# EasyEDA Pro project New Project_2025-03-25_15-12-27.eprj, schematic Schematic1

## Sheets
1 P1: Board Name: Board1; Create Date: 2025-03-25; Page Name: P1; Project Name: New Project_2025-03-25_15-12-27; Schematic Name: Schematic1; Update Date: 2025-03-27; Company: 嘉立创EDA; Page Size: A4; Version: V1.0
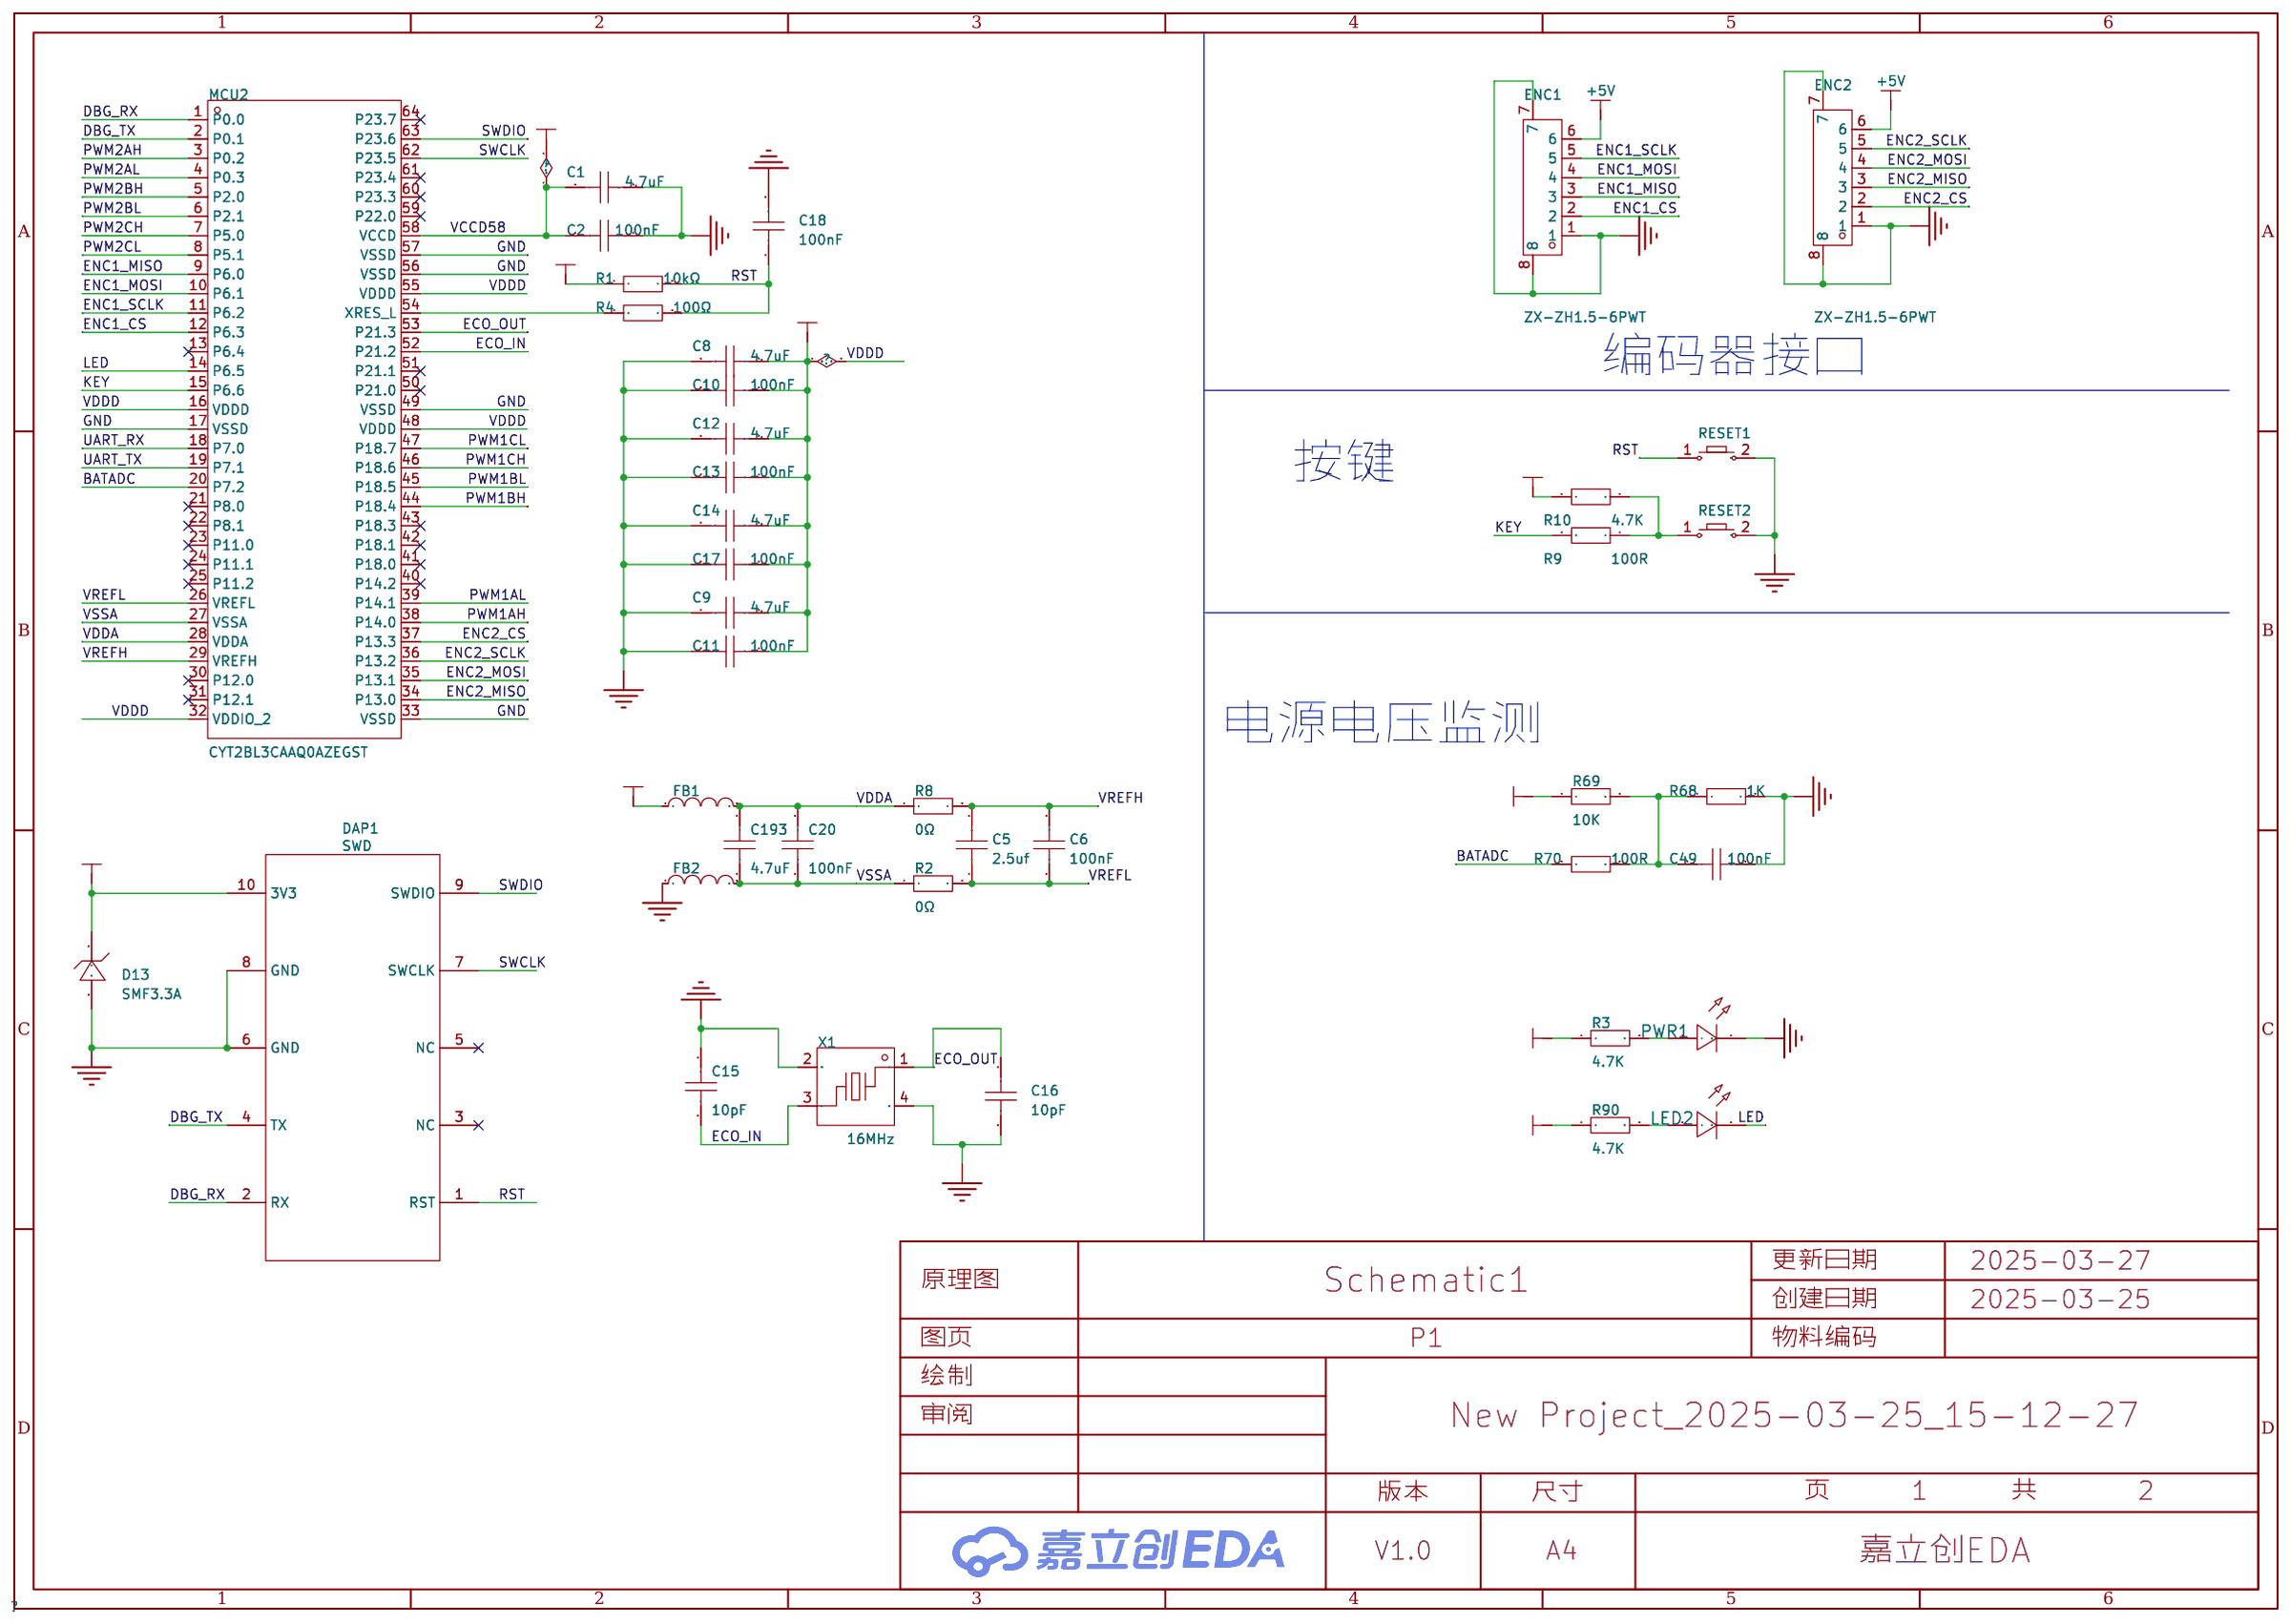
[diagram p0: P1]
2 P2: Create Date: 2025-03-27; Page Name: P2
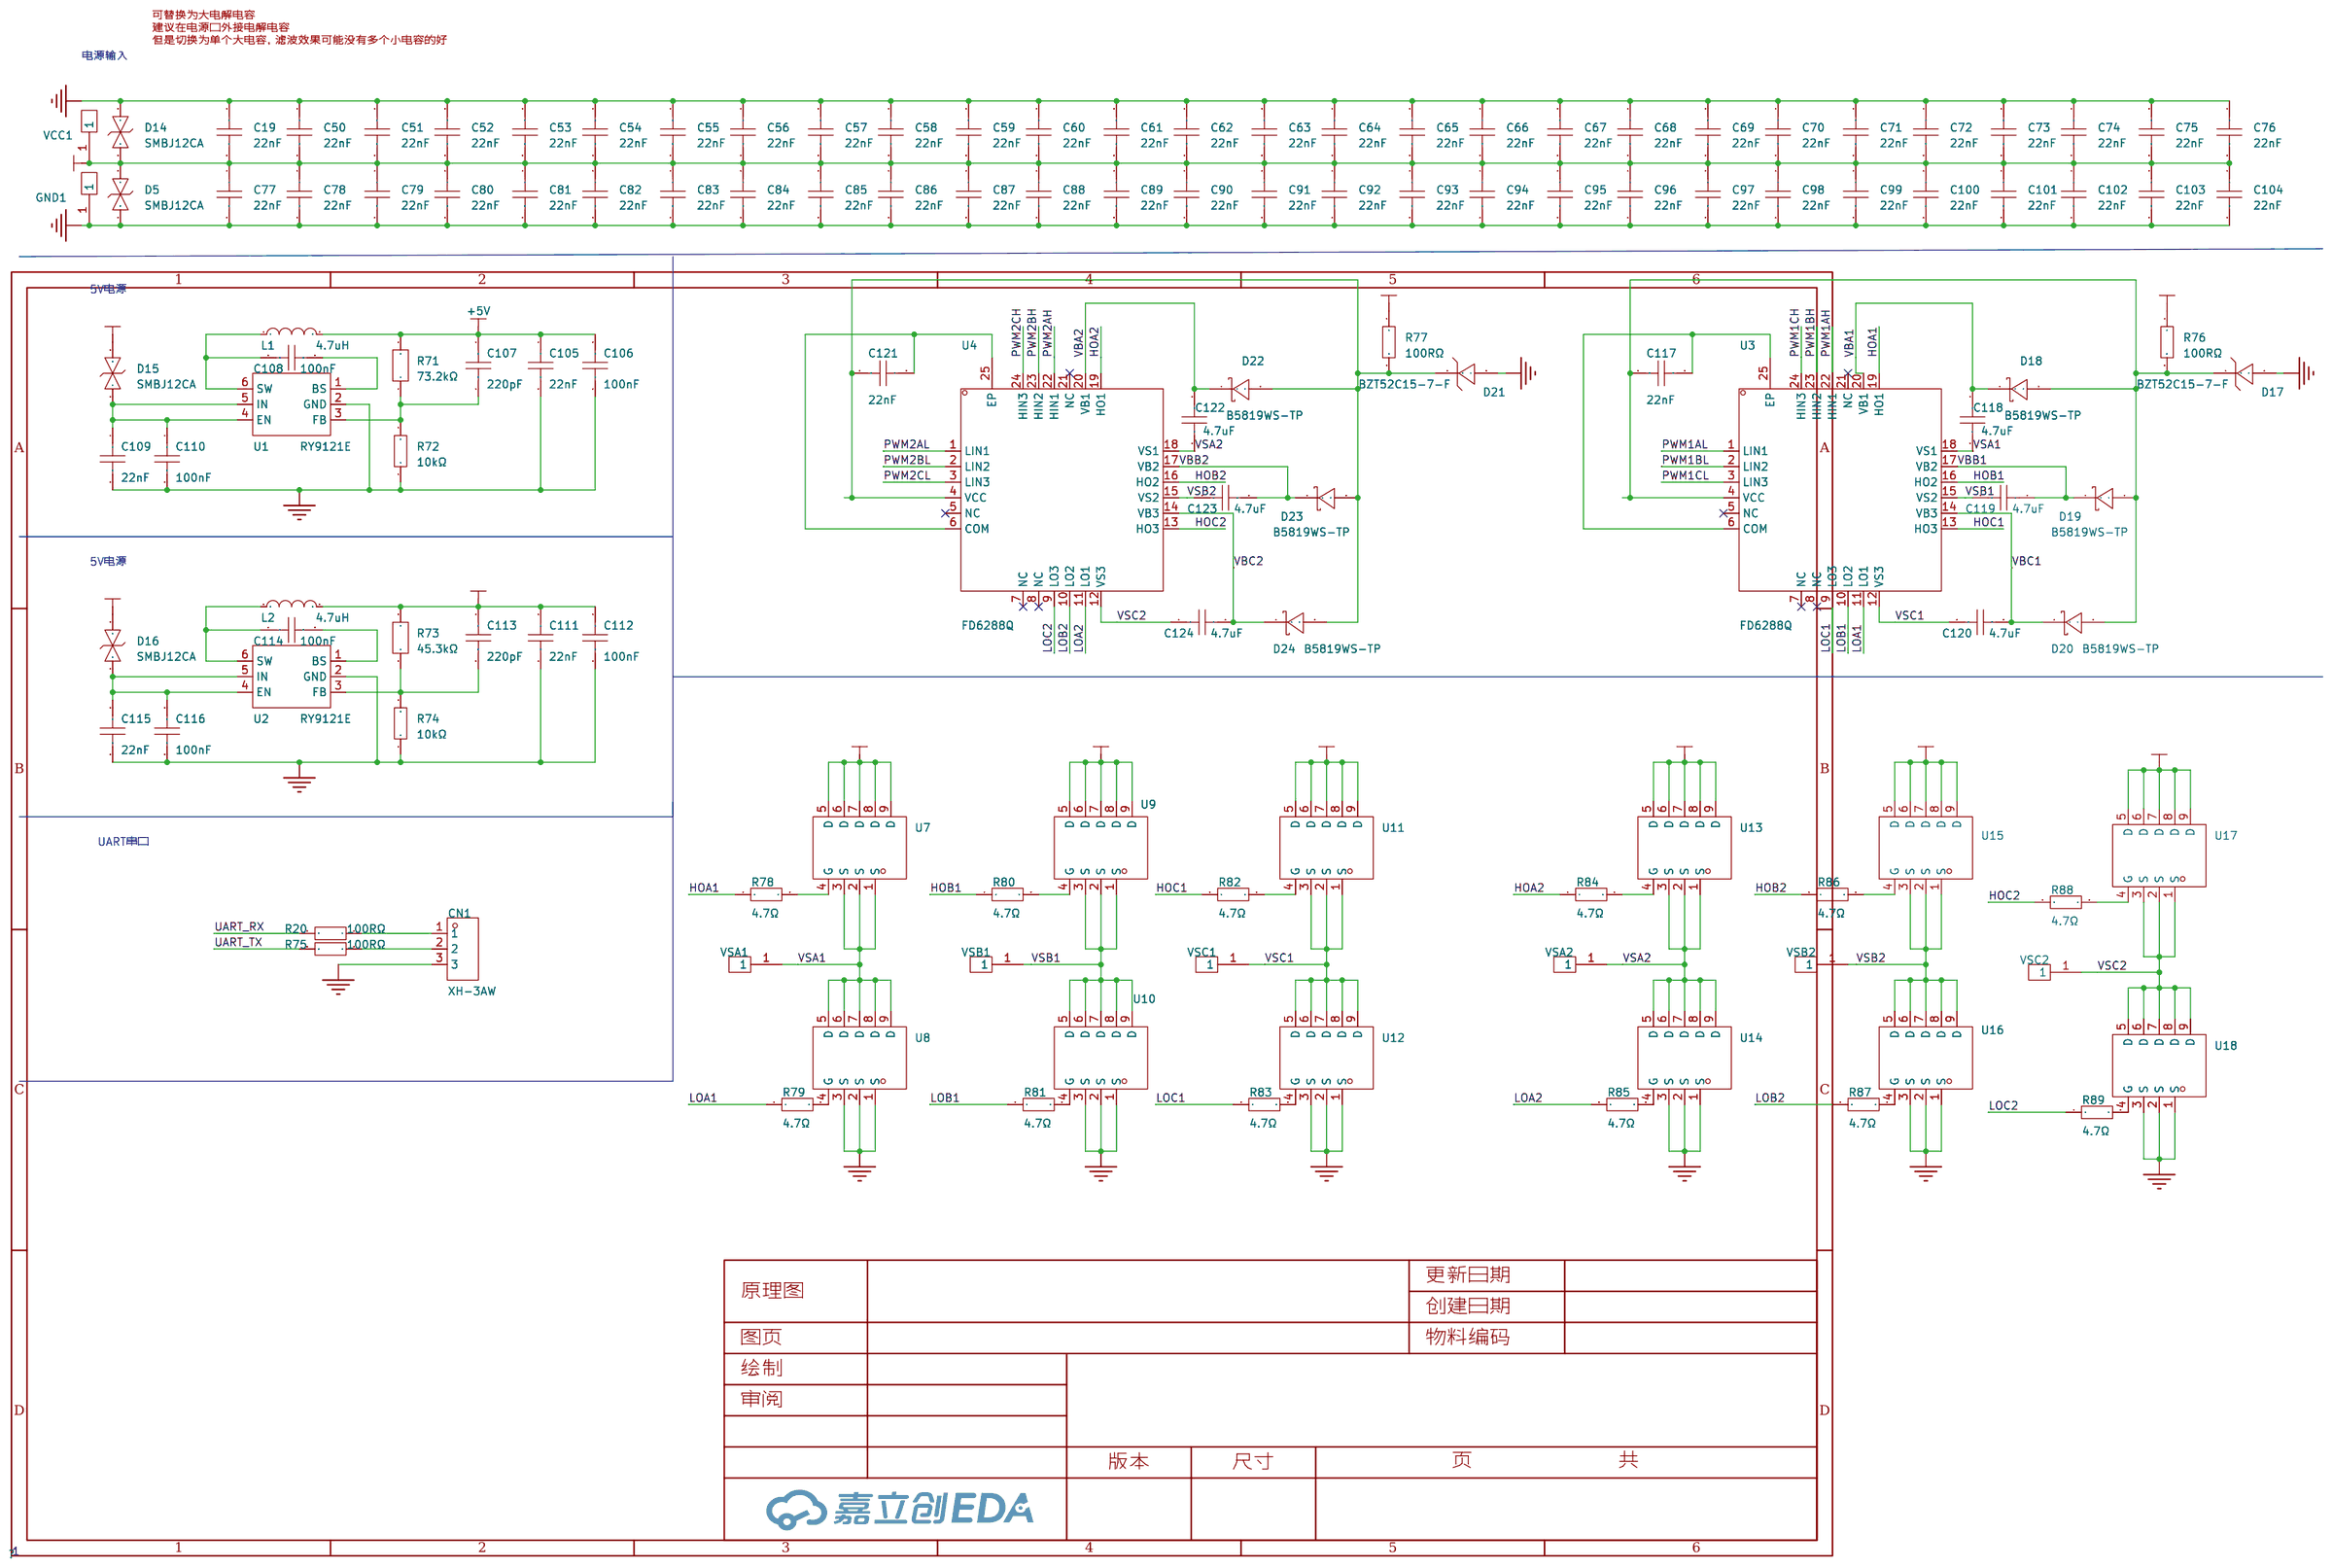
[diagram p1: P2]

## Parts
sheet P1
C1  4.7uF  [C0603]
C2  100nF  [C0603]
C5  2.5uf  [C0603]
C6  100nF  [C0603]
C8  4.7uF  [C0603]
C9  4.7uF  [C0603]
C10  100nF  [C0603]
C11  100nF  [C0603]
C12  4.7uF  [C0603]
C13  100nF  [C0603]
C14  4.7uF  [C0603]
C15  10pF  [C0603]
C16  10pF  [C0603]
C17  100nF  [C0603]
C18  100nF  [C0603]
C20  100nF  [C0603]
C49  100nF  [C0603]
C193  4.7uF  [C0603]
D13  SMF3.3A  [SOD-123_L2.8-W1.8-LS3.7-RD]
DAP1  SWD  [2X5 2.54MM双层贴片焊盘]
ENC1  ZX-ZH1.5-6PWT  [CONN-SMD_6P-P1.50_ZX-ZH1.5-6PWT]
ENC2  ZX-ZH1.5-6PWT  [CONN-SMD_6P-P1.50_ZX-ZH1.5-6PWT]
FB1  BLM18PG121SN1D  [L0603]
FB2  BLM18PG121SN1D  [L0603]
LED2  -  [LED_0603]
MCU2  CYT2BL3CAAQ0AZEGST  [LQFP-64_L10.0-W10.0-P0.50-LS12.0-BL]
PWR1  -  [LED_0603]
R1  10kΩ  [R0603]
R2  0Ω  [R0603]
R3  4.7K  [R0603]
R4  100Ω  [R0603]
R8  0Ω  [R0603]
R9  100R  [R0603]
R10  4.7K  [R0603]
R68  1K  [R0603]
R69  10K  [R0603]
R70  100R  [R0603]
R90  4.7K  [R0603]
RESET1  -  [Key_SMD_3x4x2]
RESET2  -  [Key_SMD_3x4x2]
X1  16MHz  [CRYSTAL-SMD_4P-L2.0-W1.6-BL]
sheet P2
C19  22nF  [C0603]
C50  22nF  [C0603]
C51  22nF  [C0603]
C52  22nF  [C0603]
C53  22nF  [C0603]
C54  22nF  [C0603]
C55  22nF  [C0603]
C56  22nF  [C0603]
C57  22nF  [C0603]
C58  22nF  [C0603]
C59  22nF  [C0603]
C60  22nF  [C0603]
C61  22nF  [C0603]
C62  22nF  [C0603]
C63  22nF  [C0603]
C64  22nF  [C0603]
C65  22nF  [C0603]
C66  22nF  [C0603]
C67  22nF  [C0603]
C68  22nF  [C0603]
C69  22nF  [C0603]
C70  22nF  [C0603]
C71  22nF  [C0603]
C72  22nF  [C0603]
C73  22nF  [C0603]
C74  22nF  [C0603]
C75  22nF  [C0603]
C76  22nF  [C0603]
C77  22nF  [C0603]
C78  22nF  [C0603]
C79  22nF  [C0603]
C80  22nF  [C0603]
C81  22nF  [C0603]
C82  22nF  [C0603]
C83  22nF  [C0603]
C84  22nF  [C0603]
C85  22nF  [C0603]
C86  22nF  [C0603]
C87  22nF  [C0603]
C88  22nF  [C0603]
C89  22nF  [C0603]
C90  22nF  [C0603]
C91  22nF  [C0603]
C92  22nF  [C0603]
C93  22nF  [C0603]
C94  22nF  [C0603]
C95  22nF  [C0603]
C96  22nF  [C0603]
C97  22nF  [C0603]
C98  22nF  [C0603]
C99  22nF  [C0603]
C100  22nF  [C0603]
C101  22nF  [C0603]
C102  22nF  [C0603]
C103  22nF  [C0603]
C104  22nF  [C0603]
C105  22nF  [C0603]
C106  100nF  [C0603]
C107  220pF  [C0603]
C108  100nF  [C0603]
C109  22nF  [C0603]
C110  100nF  [C0603]
C111  22nF  [C0603]
C112  100nF  [C0603]
C113  220pF  [C0603]
C114  100nF  [C0603]
C115  22nF  [C0603]
C116  100nF  [C0603]
C117  22nF  [C0603]
C118  4.7uF  [C0603]
C119  4.7uF  [C0603]
C120  4.7uF  [C0603]
C121  22nF  [C0603]
C122  4.7uF  [C0603]
C123  4.7uF  [C0603]
C124  4.7uF  [C0603]
CN1  XH-3AW  [CONN-TH_3P-P2.54_HCTL_XH-3AW]
D5  SMBJ12CA  [SMB_L4.6-W3.6-LS5.4-BI]
D14  SMBJ12CA  [SMB_L4.6-W3.6-LS5.4-BI]
D15  SMBJ12CA  [SMB_L4.6-W3.6-LS5.4-BI]
D16  SMBJ12CA  [SMB_L4.6-W3.6-LS5.4-BI]
D17  BZT52C15-7-F  [SOD-123F_L2.8-W1.8-LS3.7-RD]
D18  B5819WS-TP  [SOD-323_L1.8-W1.3-LS2.5-RD]
D19  B5819WS-TP  [SOD-323_L1.8-W1.3-LS2.5-RD]
D20  B5819WS-TP  [SOD-323_L1.8-W1.3-LS2.5-RD]
D21  BZT52C15-7-F  [SOD-123F_L2.8-W1.8-LS3.7-RD]
D22  B5819WS-TP  [SOD-323_L1.8-W1.3-LS2.5-RD]
D23  B5819WS-TP  [SOD-323_L1.8-W1.3-LS2.5-RD]
D24  B5819WS-TP  [SOD-323_L1.8-W1.3-LS2.5-RD]
GND1  -  [焊盘]
L1  4.7uH  [L0603]
L2  4.7uH  [L0603]
R20  100RΩ  [R0603]
R71  73.2kΩ  [R0603]
R72  10kΩ  [R0603]
R73  45.3kΩ  [R0603]
R74  10kΩ  [R0603]
R75  100RΩ  [R0603]
R76  100RΩ  [R0603]
R77  100RΩ  [R0603]
R78  4.7Ω  [R0603]
R79  4.7Ω  [R0603]
R80  4.7Ω  [R0603]
R81  4.7Ω  [R0603]
R82  4.7Ω  [R0603]
R83  4.7Ω  [R0603]
R84  4.7Ω  [R0603]
R85  4.7Ω  [R0603]
R86  4.7Ω  [R0603]
R87  4.7Ω  [R0603]
R88  4.7Ω  [R0603]
R89  4.7Ω  [R0603]
U1  RY9121E  [SOT-23-6_L2.9-W1.6-P0.95-LS2.8-BL]
U2  RY9121E  [SOT-23-6_L2.9-W1.6-P0.95-LS2.8-BL]
U3  FD6288Q  [QFN-24_L4.0-W4.0-P0.50-BL-EP2.6]
U4  FD6288Q  [QFN-24_L4.0-W4.0-P0.50-BL-EP2.6]
U7  TPN2R703NL,L1Q(M  [TSON-8_L3.1-W3.1-P0.65-LS3.3-BL-EP]
U8  TPN2R703NL,L1Q(M  [TSON-8_L3.1-W3.1-P0.65-LS3.3-BL-EP]
U9  TPN2R703NL,L1Q(M  [TSON-8_L3.1-W3.1-P0.65-LS3.3-BL-EP]
U10  TPN2R703NL,L1Q(M  [TSON-8_L3.1-W3.1-P0.65-LS3.3-BL-EP]
U11  TPN2R703NL,L1Q(M  [TSON-8_L3.1-W3.1-P0.65-LS3.3-BL-EP]
U12  TPN2R703NL,L1Q(M  [TSON-8_L3.1-W3.1-P0.65-LS3.3-BL-EP]
U13  TPN2R703NL,L1Q(M  [TSON-8_L3.1-W3.1-P0.65-LS3.3-BL-EP]
U14  TPN2R703NL,L1Q(M  [TSON-8_L3.1-W3.1-P0.65-LS3.3-BL-EP]
U15  TPN2R703NL,L1Q(M  [TSON-8_L3.1-W3.1-P0.65-LS3.3-BL-EP]
U16  TPN2R703NL,L1Q(M  [TSON-8_L3.1-W3.1-P0.65-LS3.3-BL-EP]
U17  TPN2R703NL,L1Q(M  [TSON-8_L3.1-W3.1-P0.65-LS3.3-BL-EP]
U18  TPN2R703NL,L1Q(M  [TSON-8_L3.1-W3.1-P0.65-LS3.3-BL-EP]
VCC1  -  [焊盘]
VSA1  -  [焊盘]
VSA2  -  [焊盘]
VSB1  -  [焊盘]
VSB2  -  [焊盘]
VSC1  -  [焊盘]
VSC2  -  [焊盘]

## Library data of the parts
C1 C2 C8-C17 C19 C20 C49-C124 C193 = CAP_0603: Supplier Footprint: 0603
C5 C6 C18 = CGA0603X7R104K500JT: 容值:100nF;精度:±10%;额定电压:50V;温度系数:X7R;; LCSC Part Name: 100nF ±10% 50V; Supplier Part: C6119867; Manufacturer: HRE(芯声); Supplier Footprint: 0603; Datasheet: https://atta.szlcsc.com/upload/public/pdf/source/20250103/C44077DA9E7B3EFAE02F22B6D3D1CBC9.pdf; Supplier: LCSC; Tolerance: ±10%; Voltage Rating: 50V; Temperature Coefficient: X7R
D13 = SMF3.3A_C283866: 反向截止电压(Vrwm):3.3V;最大钳位电压:8V;峰值脉冲电流(Ipp)@10/1000us:25A;击穿电压:5.2V;; Supplier Part: C283866; Manufacturer: DOWO(东沃); Supplier Footprint: SOD-123FL; Datasheet: https://atta.szlcsc.com/upload/public/pdf/source/20240321/1BA336232F2D97E4B026619682DB80D3.pdf; Supplier: LCSC; Reverse Stand-Off Voltage (Vrwm): 3.3V; Maximum Clamping Voltage: 8V; Peak Pulse Current (Ipp)@10/1000us: 25A; Breakdown Voltage: 5.2V; Reverse Leakage Current (Ir): 600uA; Type: TVS
DAP1 = SWD
ENC1 ENC2 = ZX-ZH1.5-6PWT: 插针结构:1x6P;间距:1.5mm;安装方式:卧贴;参考系列:ZH;总PIN数:6P;排数:1;每排PIN数:6;行距:-;额定电流:1A;触头材质:黄铜;触头镀层:锡;工作温度范围:-25℃~+85℃;; LCSC Part Name: 1x6P 间距:1.5mm 卧贴 系列:ZH; Supplier Part: C19272409; Manufacturer: Megastar(兆星); Supplier Footprint: SMD,P=1.5mm,卧贴; Datasheet: https://atta.szlcsc.com/upload/public/pdf/source/20231201/C5A824B953C40A6060EBF5A541254C86.pdf; Supplier: LCSC; Pins Structure: 1x6P; Pitch: 1.5mm; Mounting Type: 卧贴; Reference Series: ZH; Number of Pins: 6P; Number of Rows: 1; Number of PINs Per Row: 6; Rated Current: 1A; Contact Material: 黄铜; Contact Plating: 锡; Operating Temperature: -25℃~+85℃; Rated Voltage (Max): 250V; Plastic Material: LCP; Supplementary Features: 辅助焊脚; Color: 米色; Z-Height of the Board: 3.8mm; X-Length of Bottom Edge on Board (Spacing Line): 12mm; Y-Width of Bottom Edge on Board: 6.5mm
FB1 FB2 = BLM18PG121SN1D: 标称阻抗@测试频率:120Ω@100MHz;误差:±25%;直流电阻(RDC):50mΩ;; LCSC Part Name: 单路 0603磁珠 阻抗120Ω@100MHz; Supplier Part: C14709; Manufacturer: muRata(村田); Supplier Footprint: 0603; Datasheet: https://atta.szlcsc.com/upload/public/pdf/source/20130704/1457706621422.pdf; Supplier: LCSC; Impedance @ Frequency: 120Ω@100MHz; Tolerance: ±25%; DC Resistance: 50mΩ; Current Rating: 2A; Circuits: 1
LED2 PWR1 = LED_0603-R: Supplier Footprint: 0603
MCU2 = CYT2BL3CAAQ0AZEGST: CPU内核:ARM-M4；ARM-M0+;CPU最大主频:100MHz；160MHz;应用领域:-;; Supplier Part: C6814187; Manufacturer: Infineon(英飞凌); Supplier Footprint: LQFP-64(10x10); Datasheet: https://atta.szlcsc.com/upload/public/pdf/source/20241028/9C5F45A22757023D6821BF2A2597B3D9.pdf; Supplier: LCSC; CPU Core: ARM-M4；ARM-M0+; CPU Maximum Speed: 100MHz；160MHz; Number of I/O: 49; ADC (Bit): 12bit; Low Voltage Detection Threshold: 2.7V~5.5V
R1 R20 R72 R74-R77 = 0603WAF1002T5E: 电阻类型:厚膜电阻;阻值:10kΩ;精度:±1%;功率:100mW;最大工作电压:75V;温度系数:±100ppm/℃;; LCSC Part Name: 厚膜电阻 10kΩ ±1% 100mW; Supplier Part: C25804; Manufacturer: UNI-ROYAL(厚声); Supplier Footprint: 0603; Datasheet: https://atta.szlcsc.com/upload/public/pdf/source/20200306/C422600_1E6D84923E4A46A82E41ADD87F860B5C.pdf; Supplier: LCSC; Type: 厚膜电阻; Tolerance: ±1%; Power(Watts): 100mW; Overload Voltage (Max): 75V; Temperature Coefficient: ±100ppm/℃; Operating Temperature Range: -55℃~+155℃
R2 R8 = 0603WAF0000T5E: 电阻类型:厚膜电阻;阻值:0Ω;精度:±1%;功率:100mW;最大工作电压:75V;; LCSC Part Name: 0Ω ±1% 100mW 厚膜电阻; Supplier Part: C21189; Manufacturer: UNI-ROYAL(厚声); Supplier Footprint: 0603; Datasheet: https://atta.szlcsc.com/upload/public/pdf/source/20200306/C422600_1E6D84923E4A46A82E41ADD87F860B5C.pdf; Supplier: LCSC; Type: 厚膜电阻; Tolerance: ±1%; Power(Watts): 100mW; Overload Voltage (Max): 75V; Operating Temperature Range: -55℃~+155℃
R3 R9 R10 R68-R70 R90 = Res_0603: Supplier Footprint: 0603
R4 = 0603WAF1000T5E: 电阻类型:厚膜电阻;阻值:100Ω;精度:±1%;功率:100mW;最大工作电压:75V;温度系数:±200ppm/℃;; LCSC Part Name: 100Ω ±1% 100mW 厚膜电阻; Supplier Part: C22775; Manufacturer: UNI-ROYAL(厚声); Supplier Footprint: 0603; Datasheet: https://atta.szlcsc.com/upload/public/pdf/source/20200306/C422600_1E6D84923E4A46A82E41ADD87F860B5C.pdf; Supplier: LCSC; Type: 厚膜电阻; Tolerance: ±1%; Power(Watts): 100mW; Overload Voltage (Max): 75V; Temperature Coefficient: ±200ppm/℃; Operating Temperature Range: -55℃~+155℃
RESET1 RESET2 = Key_SMD_3x4x2: Supplier Footprint: SMD
X1 = XL7EL89COI-111YLC-16M: 晶振类型:贴片晶振;频率:16MHz;常温频差:±10ppm;外接负载电容:12pF;频率稳定度(全温):±20ppm;; LCSC Part Name: 16MHz ±10ppm 12pF; Supplier Part: C2965579; Manufacturer: YXC(扬兴晶振); Supplier Footprint: SMD2016-4P; Datasheet: https://atta.szlcsc.com/upload/public/pdf/source/20240329/C26C9A15A73CBCFBF373B30A8E126750.pdf; Supplier: LCSC; Crystal Type: 贴片晶振; Normal temperature Frequency Tolerance: ±10ppm; External load capacitor: 12pF; Frequency Stability(Full temperature range): ±20ppm; Operating Temperature: -40℃~+85℃
CN1 = XH-3AW_C2908612: LCSC Part Name: 1x3P 间距:2.54mm 弯插 系列:XH; Supplier Part: C2908612; Manufacturer: HCTL(华灿天禄); Supplier Footprint: 弯插,P=2.5mm; JLCPCB Part Class: 扩展库; Datasheet: https://atta.szlcsc.com/upload/public/pdf/source/20230711/B565BAF3B11666EF6B81B3605408F2BD.pdf; Supplier: LCSC; Pins Structure: 1x3P; Pitch: 2.54mm; Mounting Style: 弯插; Reference Series: XH; Number of Pins: 3P; Number of Rows: 1; Number of PINs Per Row: 3; Current Rating (Max): 3A; Contact Material: 黄铜; Contact Plating: 锡; Operating Temperature Range: -25℃~+85℃
D5 D14-D16 = SMBJ12CA_C19077566: 极性:双向;反向截止电压(Vrwm):12V;钳位电压:19.9V;峰值脉冲电流(Ipp):30.15A;峰值脉冲功率(Ppp):600W;击穿电压:13.3V;; Supplier Part: C19077566; Manufacturer: 宏嘉诚; Supplier Footprint: SMB; Datasheet: https://atta.szlcsc.com/upload/public/pdf/source/20250107/474F05451FC8AB27D7FA0238914F96F6.pdf; Supplier: LCSC; Polarity: 双向; Reverse Stand-Off Voltage (Vrwm): 12V; Clamping Voltage: 19.9V; Peak Pulse Current (Ipp): 30.15A; Peak Pulse Power Dissipation (Ppp): 600W; Voltage - Breakdown: 13.3V; Reverse Leakage Current (Ir): 5uA; Number of Channels: 单路; Type: TVS
D17 D21 = BZT52C15-7-F: Supplier Part: C177014; Manufacturer: DIODES(美台); Supplier Footprint: SOD-123; JLCPCB Part Class: 扩展库; Datasheet: https://atta.szlcsc.com/upload/public/pdf/source/20190711/C397931_3C6B91801DE45802E2D186F3C264AC27.pdf; Supplier: LCSC; Diode Configuration: 独立式; Zener Voltage (Nom): 15V; Reverse Leakage Current (Ir): 100nA@10.5V; Zener Voltage (Range): 13.8V~15.6V; Power Dissipation: 500mW; Zener Impedance (Zzt): 30Ω
D18-D20 D22-D24 = B5819WS-TP: LCSC Part Name: 电压:40V 电流:1A; Supplier Part: C78734; Manufacturer: MCC(美微科); Supplier Footprint: SOD-323; Datasheet: https://atta.szlcsc.com/upload/public/pdf/source/20190308/C78734_7BD7F562D63F05C7B4187010ADA330AA.pdf; Supplier: LCSC; Forward Voltage (Vf@If): 600mV@1A; Reverse Voltage (Vr): 40V; Average Rectified Current (Io): 1A; Reverse Leakage Current (Ir): 1mA@40V
GND1 VCC1 VSA1 VSA2 VSB1 VSB2 VSC1 VSC2 = 焊盘: Pin Type: IN; _: 3
L1 L2 = LQM18PN4R7MFRL: LCSC Part Name: 4.7uH ±20%; Supplier Part: C114862; Manufacturer: muRata(村田); Supplier Footprint: 0603; JLCPCB Part Class: 扩展库; Datasheet: https://atta.szlcsc.com/upload/public/pdf/source/20190906/C114862_C649894BBFA3713544D63EDDE3C83B81.pdf; Supplier: LCSC; Tolerance: ±20%; Rated Current: 620mA; DC Resistance (DCR): 440mΩ; Frequency - Self Resonant: 40MHz
R71 R73 = FRC0603F7322TS: LCSC Part Name: 73.2kΩ ±1% 100mW 厚膜电阻; Supplier Part: C2933257; Manufacturer: FOJAN(富捷); Supplier Footprint: 0603; JLCPCB Part Class: 扩展库; Datasheet: https://atta.szlcsc.com/upload/public/pdf/source/20211221/925EC7D7225764EE0046F22065062C87.pdf; Supplier: LCSC; Type: 厚膜电阻; Tolerance: ±1%; Power(Watts): 100mW; Overload Voltage (Max): 75V; Temperature Coefficient: ±100ppm/℃; Operating Temperature Range: -55℃~+155℃
R78-R89 = 0603WAF470KT5E: LCSC Part Name: 4.7Ω ±1% 100mW 厚膜电阻; Supplier Part: C23164; Manufacturer: UNI-ROYAL(厚声); Supplier Footprint: 0603; JLCPCB Part Class: 基础库; Datasheet: https://atta.szlcsc.com/upload/public/pdf/source/20200306/C422600_1E6D84923E4A46A82E41ADD87F860B5C.pdf; Supplier: LCSC; Type: 厚膜电阻; Tolerance: ±1%; Power(Watts): 100mW; Overload Voltage (Max): 75V; Temperature Coefficient: ±400ppm/℃; Operating Temperature Range: -55℃~+155℃
U1 U2 = RY9121E: Supplier Part: C22392164; Manufacturer: RYCHiP(蕊源); Supplier Footprint: SOT-23-6; JLCPCB Part Class: 扩展库; Supplier: LCSC
U3 U4 = FD6288Q: Supplier Part: C328453; Manufacturer: Fortior Tech(峰岹); Supplier Footprint: QFN-24-EP(4x4); JLCPCB Part Class: 扩展库; Datasheet: https://atta.szlcsc.com/upload/public/pdf/source/20241101/0E2856EB301EAFFED732065FB088D773.pdf; Supplier: LCSC
U7-U18 = TPN2R703NL,L1Q(M: Supplier Part: C5307666; Manufacturer: TOSHIBA(东芝); Supplier Footprint: TSON-8; JLCPCB Part Class: 扩展库; Datasheet: https://atta.szlcsc.com/upload/public/pdf/source/20221207/F3F28B90115C5E074AC0CD2ED28456D7.pdf; Supplier: LCSC; Type: 1个N沟道; Drain Source Voltage (Vdss): 30V; Drain Source On Resistance (RDS(on)@Vgs,Id): 3.3mΩ@4.5V,22.5A; Power Dissipation (Pd): 42W; Gate Threshold Voltage (Vgs(th)@Id): 1.3V@0.3mA; Input Capacitance (Ciss@Vds): 1.6nF@15V; Reverse Transfer Capacitance (Crss@Vds): 53pF@15V

## Nets
+3.3V: R3.1 R90.1
+5V: C105.1 C106.1 C107.1 ENC1.6 ENC2.6 L1.2 R71.2
GND: C1.1 C2.1 C8.2 C9.2 C10.2 C11.2 C12.2 C13.2 C14.2 C15.1 C16.2 C17.2 C18.2 C19.1 C49.2 C50.1 C51.1 C52.1 C53.1 C54.1 C55.1 C56.1 C57.1 C58.1 C59.1 C60.1 C61.1 C62.1 C63.1 C64.1 C65.1 C66.1 C67.1 C68.1 C69.1 C70.1 C71.1 C72.1 C73.1 C74.1 C75.1 C76.1 C77.2 C78.2 C79.2 C80.2 C81.2 C82.2 C83.2 C84.2 C85.2 C86.2 C87.2 C88.2 C89.2 C90.2 C91.2 C92.2 C93.2 C94.2 C95.2 C96.2 C97.2 C98.2 C99.2 C100.2 C101.2 C102.2 C103.2 C104.2 C105.2 C106.2 C109.2 C110.2 C111.2 C112.2 C115.2 C116.2 CN1.3 D5.1 D13.2 D14.2 D17.2(A) D21.2(A) DAP1.6(GND) DAP1.8(GND) ENC1.1 ENC1.7 ENC1.8 ENC2.1 ENC2.7 ENC2.8 FB2.1 GND1.1 MCU2.17(VSSD) MCU2.33(VSSD) MCU2.49(VSSD) MCU2.56(VSSD) MCU2.57(VSSD) PWR1.1(C) R68.2 R72.1 R74.1 RESET1.2 RESET2.2 U1.2(GND) U2.2(GND) U8.1(S) U8.2(S) U8.3(S) U10.1(S) U10.2(S) U10.3(S) U12.1(S) U12.2(S) U12.3(S) U14.1(S) U14.2(S) U14.3(S) U16.1(S) U16.2(S) U16.3(S) U18.1(S) U18.2(S) U18.3(S) X1.2(GND) X1.4(GND)
VBAT: C19.2 C50.2 C51.2 C52.2 C53.2 C54.2 C55.2 C56.2 C57.2 C58.2 C59.2 C60.2 C61.2 C62.2 C63.2 C64.2 C65.2 C66.2 C67.2 C68.2 C69.2 C70.2 C71.2 C72.2 C73.2 C74.2 C75.2 C76.2 C77.1 C78.1 C79.1 C80.1 C81.1 C82.1 C83.1 C84.1 C85.1 C86.1 C87.1 C88.1 C89.1 C90.1 C91.1 C92.1 C93.1 C94.1 C95.1 C96.1 C97.1 C98.1 C99.1 C100.1 C101.1 C102.1 C103.1 C104.1 D5.2 D14.1 D15.2 D16.2 R69.1 R76.1 R77.1 U7.5(D) U7.6(D) U7.7(D) U7.8(D) U7.9(D) U9.5(D) U9.6(D) U9.7(D) U9.8(D) U9.9(D) U11.5(D) U11.6(D) U11.7(D) U11.8(D) U11.9(D) U13.5(D) U13.6(D) U13.7(D) U13.8(D) U13.9(D) U15.5(D) U15.6(D) U15.7(D) U15.8(D) U15.9(D) U17.5(D) U17.6(D) U17.7(D) U17.8(D) U17.9(D) VCC1.1
VCC1V1: C1.2 C2.2 MCU2.58(VCCD)
VCC3V3: C8.1 C9.1 C10.1 C11.1 C12.1 C13.1 C14.1 C17.1 C111.1 C112.1 C113.1 D13.1 DAP1.10(3V3) FB1.1 L2.2 MCU2.16(VDDD) MCU2.32(VDDIO_2) MCU2.48(VDDD) MCU2.55(VDDD) R1.1 R10.2 R73.2
VDDA: C20.1 C193.1 FB1.2 MCU2.28(VDDA) R8.1
VSSA: C20.2 C193.2 FB2.2 MCU2.27(VSSA) R2.1
BATADC: MCU2.20(P7.2) R70.1
DBG_RX: DAP1.2(RX) MCU2.1(P0.0)
DBG_TX: DAP1.4(TX) MCU2.2(P0.1)
ECO_IN: C15.2 MCU2.52(P21.2) X1.3
ECO_OUT: C16.1 MCU2.53(P21.3) X1.1
ENC1_CS: ENC1.2 MCU2.12(P6.3)
ENC1_MISO: ENC1.3 MCU2.9(P6.0)
ENC1_MOSI: ENC1.4 MCU2.10(P6.1)
ENC1_SCLK: ENC1.5 MCU2.11(P6.2)
ENC2_CS: ENC2.2 MCU2.37(P13.3)
ENC2_MISO: ENC2.3 MCU2.34(P13.0)
ENC2_MOSI: ENC2.4 MCU2.35(P13.1)
ENC2_SCLK: ENC2.5 MCU2.36(P13.2)
HOA1: R78.1 U3.19(HO1)
HOA2: R84.1 U4.19(HO1)
HOB1: R80.1 U3.16(HO2)
HOB2: R86.1 U4.16(HO2)
HOC1: R82.1 U3.13(HO3)
HOC2: R88.1 U4.13(HO3)
KEY: MCU2.15(P6.6) R9.2
LED: LED2.1(C) MCU2.14(P6.5)
LOA1: R79.1 U3.11(LO1)
LOA2: R85.1 U4.11(LO1)
LOB1: R81.1 U3.10(LO2)
LOB2: R87.1 U4.10(LO2)
LOC1: R83.1 U3.9(LO3)
LOC2: R89.1 U4.9(LO3)
PWM1AH: MCU2.38(P14.0) U3.22(HIN1)
PWM1AL: MCU2.39(P14.1) U3.1(LIN1)
PWM1BH: MCU2.44(P18.4) U3.23(HIN2)
PWM1BL: MCU2.45(P18.5) U3.2(LIN2)
PWM1CH: MCU2.46(P18.6) U3.24(HIN3)
PWM1CL: MCU2.47(P18.7) U3.3(LIN3)
PWM2AH: MCU2.3(P0.2) U4.22(HIN1)
PWM2AL: MCU2.4(P0.3) U4.1(LIN1)
PWM2BH: MCU2.5(P2.0) U4.23(HIN2)
PWM2BL: MCU2.6(P2.1) U4.2(LIN2)
PWM2CH: MCU2.7(P5.0) U4.24(HIN3)
PWM2CL: MCU2.8(P5.1) U4.3(LIN3)
RST: C18.1 DAP1.1(RST) R1.2 R4.2 RESET1.1
SWCLK: DAP1.7(SWCLK) MCU2.62(P23.5)
SWDIO: DAP1.9(SWDIO) MCU2.63(P23.6)
UART_RX: MCU2.18(P7.0) R20.2
UART_TX: MCU2.19(P7.1) R75.2
VBA1: C118.1 D18.1(K) U3.20(VB1)
VBA2: C122.1 D22.1(K) U4.20(VB1)
VBB1: C119.2 D19.1(K) U3.17(VB2)
VBB2: C123.2 D23.1(K) U4.17(VB2)
VBC1: C120.2 D20.1(K) U3.14(VB3)
VBC2: C124.2 D24.1(K) U4.14(VB3)
VREFH: C5.2 C6.2 MCU2.29(VREFH) R8.2
VREFL: C5.1 C6.1 MCU2.26(VREFL) R2.2
VSA1: C118.2 U3.18(VS1) U7.1(S) U7.2(S) U7.3(S) U8.5(D) U8.6(D) U8.7(D) U8.8(D) U8.9(D) VSA1.1
VSA2: C122.2 U4.18(VS1) U13.1(S) U13.2(S) U13.3(S) U14.5(D) U14.6(D) U14.7(D) U14.8(D) U14.9(D) VSA2.1
VSB1: C119.1 U3.15(VS2) U9.1(S) U9.2(S) U9.3(S) U10.5(D) U10.6(D) U10.7(D) U10.8(D) U10.9(D) VSB1.1
VSB2: C123.1 U4.15(VS2) U15.1(S) U15.2(S) U15.3(S) U16.5(D) U16.6(D) U16.7(D) U16.8(D) U16.9(D) VSB2.1
VSC1: C120.1 U3.12(VS3) U11.1(S) U11.2(S) U11.3(S) U12.5(D) U12.6(D) U12.7(D) U12.8(D) U12.9(D) VSC1.1
VSC2: C124.1 U4.12(VS3) U17.1(S) U17.2(S) U17.3(S) U18.5(D) U18.6(D) U18.7(D) U18.8(D) U18.9(D) VSC2.1
$1N1712: MCU2.54(XRES_L) R4.1
$1N1753: R9.1 R10.1 RESET2.1
$1N1759: C49.1 R68.1 R69.2 R70.2
$1N3506: PWR1.2(A) R3.2
$1N3509: LED2.2(A) R90.2
$2N2714: C107.2 R71.1 R72.2 U1.3(FB)
$2N2924: C108.2 U1.1(BS)
$2N2932: C108.1 L1.1 U1.6(SW)
$2N3008: C109.1 C110.1 D15.1 U1.4(EN) U1.5(IN)
$2N3480: C115.1 C116.1 D16.1 U2.4(EN) U2.5(IN)
$2N3496: C114.1 L2.1 U2.6(SW)
$2N3502: C113.2 R73.1 R74.2 U2.3(FB)
$2N3508: C114.2 U2.1(BS)
$2N3712: CN1.2 R75.1
$2N3716: CN1.1 R20.1
$2N4660: C117.2 U3.6(COM) U3.25(EP)
$2N5343: C117.1 D17.1(K) D18.2(A) D19.2(A) D20.2(A) R76.2 U3.4(VCC)
$2N5939: C121.2 U4.6(COM) U4.25(EP)
$2N5985: C121.1 D21.1(K) D22.2(A) D23.2(A) D24.2(A) R77.2 U4.4(VCC)
$2N12019: R78.2 U7.4(G)
$2N12335: R79.2 U8.4(G)
$2N12658: R80.2 U9.4(G)
$2N12663: R81.2 U10.4(G)
$2N12936: R82.2 U11.4(G)
$2N12941: R83.2 U12.4(G)
$2N14524: R84.2 U13.4(G)
$2N14529: R85.2 U14.4(G)
$2N14559: R86.2 U15.4(G)
$2N14564: R87.2 U16.4(G)
$2N14594: R88.2 U17.4(G)
$2N14599: R89.2 U18.4(G)

Not connected (* = marked no-connect by the designer): DAP1 3(NC)* 5(NC)*; MCU2 13(P6.4)* 21(P8.0)* 22(P8.1)* 23(P11.0)* 24(P11.1)* 25(P11.2)* 30(P12.0)* 31(P12.1)* 40(P14.2)* 41(P18.0)* 42(P18.1)* 43(P18.3)* 50(P21.0)* 51(P21.1)* 59(P22.0)* 60(P23.3)* 61(P23.4)* 64(P23.7)*; U3 5(NC)* 7(NC)* 8(NC)* 21(NC)*; U4 5(NC)* 7(NC)* 8(NC)* 21(NC)*

## Notes on the sheets
sheet 1
- 编码器接口
- 按键
- 电源电压监测
sheet 2
- 可替换为大电解电容
  建议在电源口外接电解电容
  但是切换为单个大电容，滤波效果可能没有多个小电容的好
- 电源输入
- 5V电源
- 5V电源
- UART串口
